# Altium project pcb2.PrjPcb
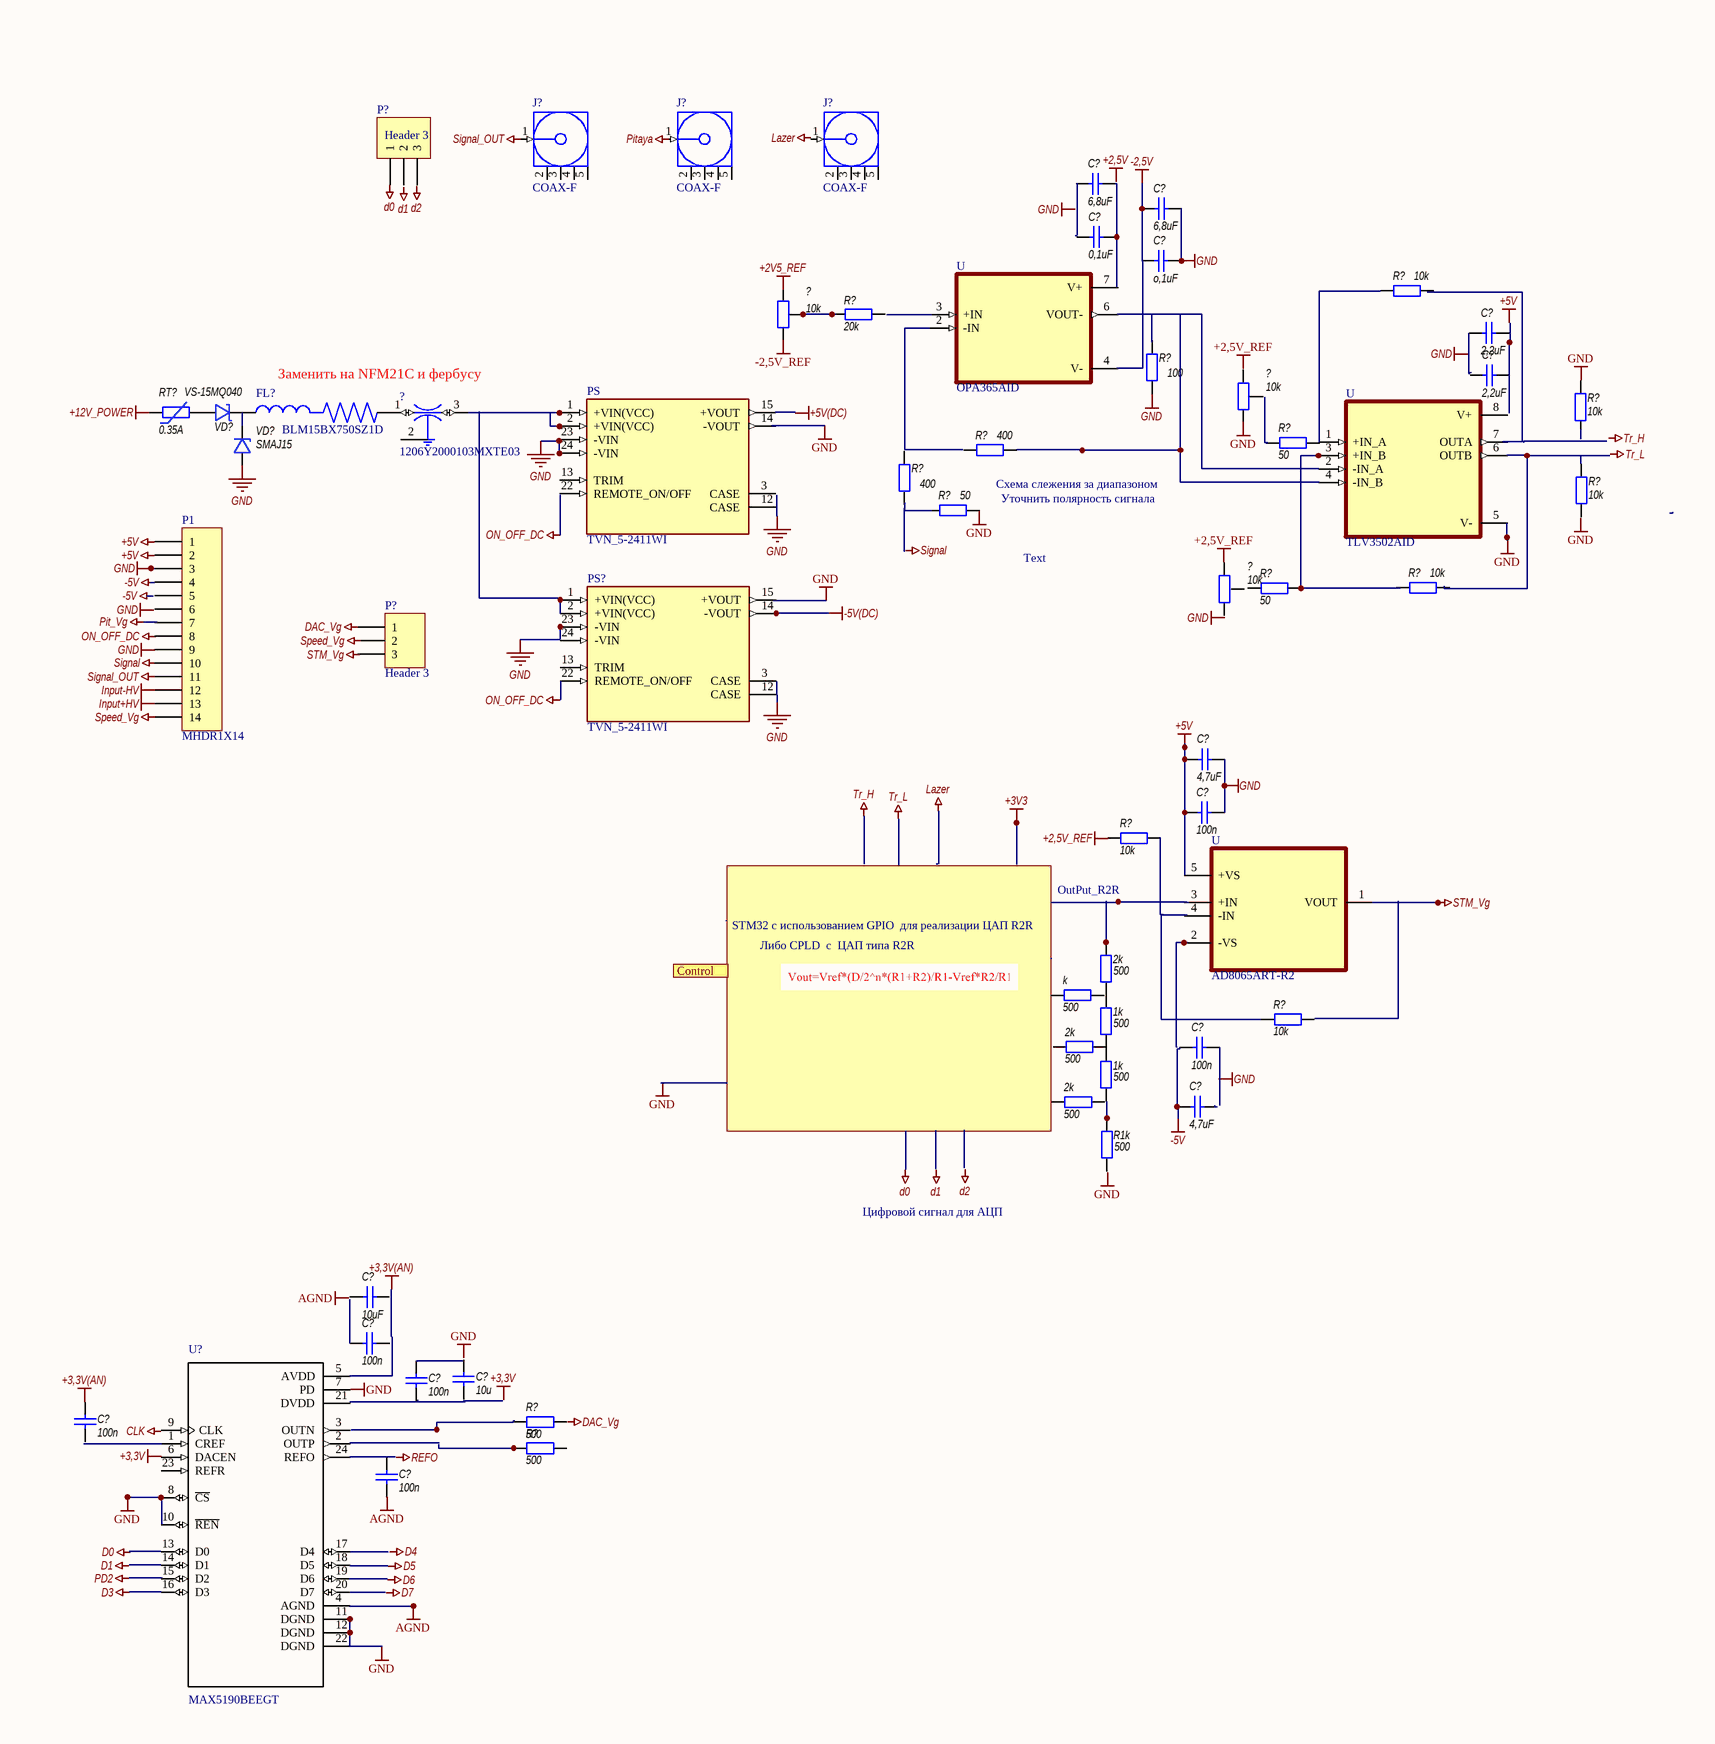
[diagram p0: Power_DC1.SchDoc, left]
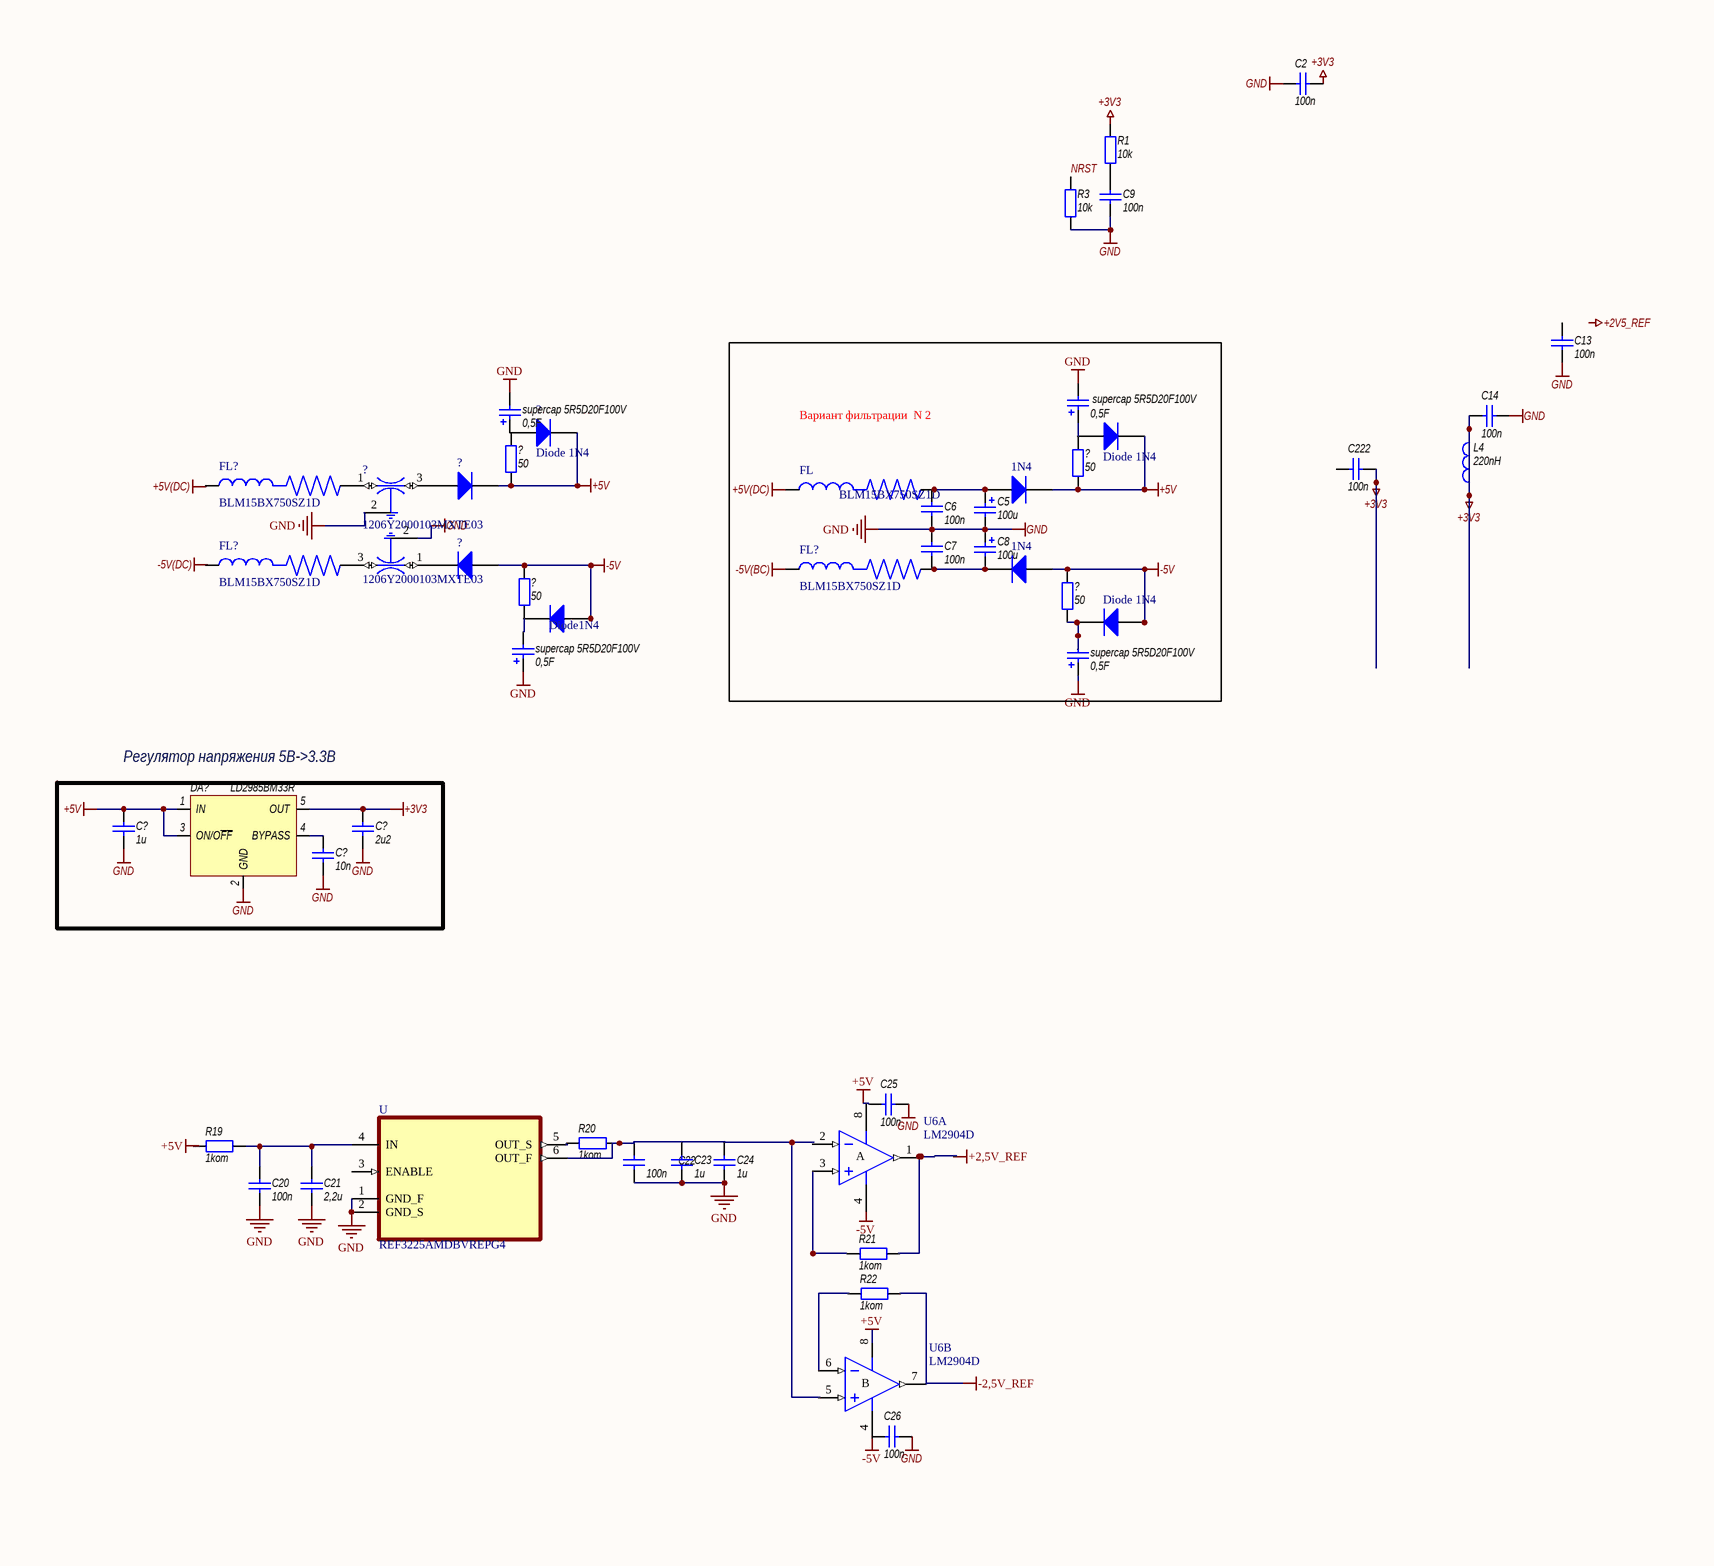
[diagram p1: Power_DC1.SchDoc, right]
1 sheet, 109 parts. Net scope: flat (ports and power ports of the same name join across sheets).

## Sheet Power_DC1.SchDoc
size A2

### Parts
(Parts that share a designator on the sheet are numbered #1, #2 ... from top to bottom, then left to right.)
1k#1  500  [0603]
1k#2  500  [0603]
1N4#1  (no value)  [DO-41]
1N4#2  (no value)  [DO-41]
2k#1  500  [0603]
2k#2  500  [0603]
2k#3  500  [0603]
?#1  Diode 1N4  [DO-41]
?#2  Diode 1N4  [DO-41]
?#3  (no value)  [DO-41]
?#4  1206Y2000103MXTE03  [FIL_1206Y2000103MXTE03]
?#5  50  [0603]
?#6  50  [0603]
?#7  10k  [R-Tr 3107W]
?#8  1206Y2000103MXTE03  [FIL_1206Y2000103MXTE03]
?#9  (no value)  [DO-41]
?#10  10k  [R-Tr 3107W]
?#11  50  [0603]
?#12  1206Y2000103MXTE03  [FIL_1206Y2000103MXTE03]
?#13  50  [0603]
?#14  Diode1N4  [DO-41]
?#15  10k  [R-Tr 3107W]
C2  100n  [0603]
C5  100u  [CAP TANTAL 6032 - Type C]
C6  100n  [0603]
C7  100n  [0603]
C8  100u  [CAP TANTAL 6032 - Type C]
C9  100n  [0603]
C13  100n  [0603]
C14  100n  [0603]
C20  100n  [0603]
C21  2,2u  [0603]
C22  100n  [0603]
C23  1u  [0603]
C24  1u  [0603]
C25  100n  [0603]
C26  100n  [0603]
C222  100n  [0603]
C?#1  6,8uF  [0603]
C?#2  6,8uF  [0603]
C?#3  0,1uF  [0603]
C?#4  o,1uF  [0603]
C?#5  2,2uF  [0603]
C?#6  2,2uF  [0603]
C?#7  1u  [0603]
C?#8  2u2  [0603]
C?#9  10n  [0603]
C?#10  4,7uF  [0603]
C?#11  100n  [0603]
C?#12  100n  [0603]
C?#13  4,7uF  [0603]
C?#14  10uF  [0603]
C?#15  100n  [0603]
C?#16  10u  [0603]
C?#17  100n  [0603]
C?#18  100n  [0603]
C?#19  100n  [0603]
DA?  LD2985BM33R  [SOT23-5]
Diode_1N4  (no value)  [DO-41]
FL  BLM15BX750SZ1D  [BEADC1005X55N]
FL?#1  BLM15BX750SZ1D  [BEADC1005X55N]
FL?#2  BLM15BX750SZ1D  [BEADC1005X55N]
FL?#3  BLM15BX750SZ1D  [BEADC1005X55N]
FL?#4  BLM15BX750SZ1D  [BEADC1005X55N]
J?#1  COAX-F  [MCX5.08-H5]
J?#2  COAX-F  [MCX5.08-H5]
J?#3  COAX-F  [MCX5.08-H5]
k  500  [0603]
L4  220nH  [0805]
P1  MHDR1X14  [MHDR1X14]
P?#1  Header 3  [HDR1X3]
P?#2  Header 3  [HDR1X3]
PS  TVN_5-2411WI  [CONV_TVN_5-2415WI]
PS?  TVN_5-2411WI  [CONV_TVN_5-2415WI]
R1  10k  [0603]
R1k  500  [0603]
R3  10k  [0603]
R19  1kom  [0603]
R20  1kom  [0603]
R21  1kom  [0603]
R22  1kom  [0603]
R?#1  10k  [0603]
R?#2  20k  [0603]
R?#3  10k  [0603]
R?#4  100  [0603]
R?#5  50  [0603]
R?#6  400  [0603]
R?#7  10k  [0603]
R?#8  400  [0603]
R?#9  50  [0603]
R?#10  50  [0603]
R?#11  10k  [0603]
R?#12  10k  [0603]
R?#13  10k  [0603]
R?#14  500  [0603]
R?#15  500  [0603]
RT?  0.35A  [1812]
supercap_5R5D20F100V#1  0,5F  [CAP TANTAL 6032 - Type C]
supercap_5R5D20F100V#2  0,5F  [CAP TANTAL 6032 - Type C]
supercap_5R5D20F100V#3  0,5F  [CAP TANTAL 6032 - Type C]
supercap_5R5D20F100V#4  0,5F  [CAP TANTAL 6032 - Type C]
U6  LM2904D  [SO8_L]  (parts A,B of 2)
U#1  OPA365AID  [SOIC127P599X175-8N]
U#2  TLV3502AID  [SOIC127P599X175-8N]
U#3  AD8065ART-R2  [SOT95P290X145-5N]
U#4  REF3225AMDBVREPG4  [SOT95P280X145-6N]
U?  MAX5190BEEGT  [*SOP63P602X175-24N]
VD?#1  VS-15MQ040  [DO-214AC (SMA)]
VD?#2  SMAJ15  [DO-214AC (SMA)]

### Blocks framed on the sheet
Вариант фильтрации  N 2: 1N4#1 1N4#2 ?#2 ?#6 ?#13 C5-C8 Diode_1N4 FL FL?#3 supercap_5R5D20F100V#1 supercap_5R5D20F100V#4

### Ports
Control (in)

### Nets
+3V3: C2.1 C14.1 C222.1 C?#8.2 DA?.5(OUT) L4.1 L4.2 R1.1
+5V: 1N4#1.2(K) ?#1.2(K) ?#2.2(K) ?#3.2(K) ?#5.1 ?#6.1 C25.2 C?#7.2 C?#10.1 C?#11.2 DA?.1(IN) DA?.3(ON/O~{FF}) U6.8(V+)
+5V(DC): FL.1
+12V_POWER: RT?.1
-2,5V_REF: U6.7(OUT)
-5V: 1N4#2.1(A) ?#9.1(A) ?#11.2 ?#13.2 ?#14.1(A) C26.2 C?#12.2 C?#13.1 Diode_1N4.1(A) P1.4
-5V(DC): PS?.14(-VOUT)
-5V(ВС): FL?#3.1
AGND: U?.4(AGND)
D0: P?#1.1
D3: U?.16(D3)
DAC_Vg: P?#2.1
GND: ?#4.2(GND) ?#8.2(GND) C2.2 C5.2 C6.1 C7.2 C8.1 C9.2 C13.2 C14.2 C20.1 C21.1 C22.1 C23.1 C24.1 C25.1 C26.1 C?#2.1 C?#4.1 C?#7.1 C?#8.1 C?#9.1 C?#10.2 C?#11.1 DA?.2(GND) P1.3 P1.9 PS.14(-VOUT) PS.24(-VIN) PS?.15(+VOUT) PS?.23(-VIN) R3.2 supercap_5R5D20F100V#1.2 supercap_5R5D20F100V#2.2 supercap_5R5D20F100V#3.1 supercap_5R5D20F100V#4.1 U#4.1(GND_F) U#4.2(GND_S) U?.8(~{CS}) U?.11(DGND) U?.12(DGND) U?.22(DGND) VD?#2.1(A)
Input+HV: P1.13
Input-HV: P1.12
Signal_OUT: J?#1.1(Signal) P1.11
Speed_Vg: P1.14
STM_Vg: U#3.1(VOUT)
NRST: R3.1
Net1N4#1_1: 1N4#1.1(A) C5.1 C6.2 FL.2
Net1N4#2_2: 1N4#2.2(K) C7.1 C8.2 FL?#3.2
Net?#1_1: ?#1.1(A) supercap_5R5D20F100V#2.1
Net?#3_1: ?#3.1(A) ?#4.3(B)
Net?#6_2: ?#6.2 supercap_5R5D20F100V#1.1
Net?#7_2: ?#7.2 R?#2.1
Net?#8_1: ?#8.1(A) ?#9.2(K)
Net?#11_1: ?#11.1 supercap_5R5D20F100V#3.2
Net?#12_3: ?#12.3(B) PS.1(+VIN(VCC)) PS.2(+VIN(VCC))
Net?#13_1: ?#13.1 Diode_1N4.2(K) supercap_5R5D20F100V#4.2
NetC9_1: C9.1 R1.2
NetC20_2: C20.2 C21.2 R19.1 U#4.4(IN)
NetC22_2: C22.2 R20.1 U#4.6(OUT_F)
NetC?#1_1: C?#1.1 C?#3.1
NetC?#2_2: C?#2.2 C?#4.2 U#1.4(V-)
NetC?#9_2: C?#9.2 DA?.4(BYPASS)
NetFL?#4_1: FL?#4.1 VD?#1.2(K) VD?#2.2(K)
NetPS?_1: PS?.1(+VIN(VCC)) PS?.2(+VIN(VCC))
NetR20_2: R20.2 U#4.5(OUT_S)
NetR?#4_2: R?#4.2 U#1.6(VOUT-)
NetR?#6_2: R?#6.2 U#2.4(-IN_B)
NetR?#8_1: R?#8.1 R?#9.1
NetR?#10_2: R?#10.2 R?#11.1 U#2.3(+IN_B)
NetRT?_2: RT?.2 VD?#1.1(A)

Not connected (* = marked no-connect by the designer): 1k#1 1 2; 1k#2 1 2; 2k#1 1 2; 2k#2 1 2; 2k#3 1 2; ?#2 1(A); ?#4 1(A); ?#5 2; ?#7 1 3; ?#8 3(B); ?#10 1 2 3; ?#12 1(A) 2(GND); ?#14 2(K); ?#15 1 2 3; C13 1; C23 2; C24 2; C222 2; C?#1 2; C?#3 2; C?#5 1 2; C?#6 1 2; C?#12 1; C?#13 2; C?#14 1 2; C?#15 1 2; C?#16 1 2; C?#17 1 2; C?#18 1 2; C?#19 1 2; FL?#1 1 2; FL?#2 1 2; FL?#4 2; J?#1 2(GND) 3(GND) 4(GND) 5(GND); J?#2 1(Signal) 2(GND) 3(GND) 4(GND) 5(GND); J?#3 1(Signal) 2(GND) 3(GND) 4(GND) 5(GND); k 1 2; P1 1 2 5 6 7 8 10; P?#1 2 3; P?#2 2 3; PS 3(CASE) 12(CASE) 13(TRIM) 15(+VOUT) 22(REMOTE_ON/OFF) 23(-VIN); PS? 3(CASE) 12(CASE) 13(TRIM) 22(REMOTE_ON/OFF) 24(-VIN); R1k 1 2; R19 2; R21 1 2; R22 1 2; R?#1 1 2; R?#2 2; R?#3 1 2; R?#4 1; R?#5 1 2; R?#6 1; R?#7 1 2; R?#8 2; R?#9 2; R?#10 1; R?#11 2; R?#12 1 2; R?#13 1 2; R?#14 1 2; R?#15 1 2; U6 1(OUT) 2(IN-) 3(IN+) 4(V-) 5(IN+) 6(IN-); U#1 2(-IN) 3(+IN) 7(V+); U#2 1(+IN_A) 2(-IN_A) 5(V-) 6(OUTB) 7(OUTA) 8(V+); U#3 2(-VS) 3(+IN) 4(-IN) 5(+VS); U#4 3(ENABLE); U? 1(CREF) 2(OUTP) 3(OUTN) 5(AVDD) 6(DACEN) 7(PD) 9(CLK) 10(~{REN}) 13(D0) 14(D1) 15(D2) 17(D4) 18(D5) 19(D6) 20(D7) 21(DVDD) 23(REFR) 24(REFO)

### Notes on the sheet
- Заменить на NFM21C и фербусу
- (near R?#6) Схема слежения за диапазоном
- (near R?#9) Уточнить полярность сигнала
- Text
- Регулятор напряжения 5В->3.3В
- OutPut_R2R
- STM32 с использованием GPIO  для реализации ЦАП R2R
- Либо CPLD  с  ЦАП типа R2R
- Цифровой сигнал для АЦП
- Labels drawn without touching a wire or pin: +2,5V, +2,5V_REF, +2V5_REF, +3,3V, +3,3V(AN), +5V, +5V(DC), -2,5V, -2,5V_REF, -5V, -5V(DC), AGND, CLK, d0, D0, d1, D1, d2, D4, D5, D6, D7, DAC_Vg, GND, Lazer, ON_OFF_DC, Pitaya, REFO, Signal, Speed_Vg, STM_Vg, Tr_H, Tr_L
- (in symbol LM2904D, part A) A
- (in symbol LM2904D, part B) B

### Library data of the parts
1k#1 1k#2 2k#1-2k#3 ?#5 ?#6 ?#11 ?#13 k R1k R?#2 R?#14 R?#15 = _resistor: Model: 0603 10k; Value: 10k
1N4#1 1N4#2 ?#1-?#3 ?#9 ?#14 Diode_1N4 = Diode 1N4934: 1 Amp Fast Recovery Rectifier; Published: 8-Jun-2000; LatestRevisionDate: 17-Jul-2002; LatestRevisionNote: Re-released for DXP Platform.; DatasheetVersion: 1999; PackageVersion: Aug-1999; PackageReference: DO-41; Publisher: Altium Limited; PackageDescription: Diode, Axial; Body 5.2 x 2.7 mm (LxDia. max), Lead Dia. 0.86 mm (max); Code_JEDEC: DO-204-AL; ComponentLink1Description: Manufacturer Link; ComponentLink1URL: http://www.fairchildsemi.com/; ComponentLink2Description: Datasheet; ComponentLink2URL: http://www.fairchildsemi.com/ds/1N%2F1N4934.pdf
?#4 ?#8 ?#12 = 1206Y2000103MXTE03: ÐŸÐ¸Ñ‚Ð°Ð½Ð¸Ðµ Ñ‡ÐµÑ€ÐµÐ· ÐºÐ¾Ð½Ð´ÐµÐ½ÑÐ°Ñ‚Ð¾Ñ€Ñ‹ 1206 200Ð’ .01uF 20% X7R X2y Ñ„Ð¸Ð»ÑŒÑ‚Ñ€; MF: Syfer; Availability: Unavailable; SnapEDA_Link: https://www.snapeda.com/parts/1206Y2000103MXTE03/Syfer/view-part/1659626/?ref=snap; Package: 1206 Syfer; MP: 1206Y2000103MXTE03; Value: *; Price: None
?#7 ?#10 ?#15 = _resistor_pot: Model: 3266P-1-102LF; Value: 1k
C2 C6 C7 C9 C13 C14 C20 C22 C25 C26 C222 C?#11 C?#12 C?#15 C?#17-C?#19 = _capacitor: Model: 0603 100n; Value: 100n
C5 C8 = _capacitor_pol: Model: Чип Тант. 6.3V 100uF 20% C; Value: 100u
C21 C23 C24 C?#1-C?#6 C?#10 C?#13 C?#14 C?#16 = _capacitor: Model: 0603 100n; Value: 100n
C?#7 = _capacitor: Model: 0603 1u; Value: 1u
C?#8 = _capacitor: Model: 0603 2u2; Value: 2u2
C?#9 = _capacitor: Model: 0603 10n; Value: 10n
DA? = LD2985: Linear Regulator; Model: LD2985BM33R; ComponentLink1URL: X:\Projects\__MY_AD_LIB\Datasheets\lp2985-n.pdf; ComponentLink1Description: Datasheet
FL FL?#1-FL?#4 = BLM15BX750SZ1D: Ñ„ÐµÑ€Ñ€Ð¸Ñ‚Ð¾Ð²Ð°Ñ ÑˆÐ°Ð¹Ð±Ð°; MF: Murata; SnapEDA_Link: https://www.snapeda.com/parts/BLM15BX750SZ1D/Murata/view-part/2734322/?ref=snap; Value: *; MP: BLM15BX750SZ1D; Availability: Unavailable; Package: 1005 Taiyo Yuden; Price: None
J?#1-J?#3 = COAX-F: RF Coaxial PCB Connector, MCX; Thru-Hole, Right-Angle Mount Socket, Blunt Post Terminal, 50 Ohm Impedance; PCB_Layout: Complies with manufacturer's recommendation.; DrillSize: Corresponds to nominal value.; Published: 15-Jul-2004; LatestRevisionDate: 15-Jul-2004; LatestRevisionNote: Component Replaced.; DatasheetDocument: 30-May-2003; PackageDocument: 04-Jul-1999; PackageReference: 919-119J-51AX; Publisher: Altium Limited; ComponentLink1Description: Manufacturer Link; ComponentLink1URL: http://www.amphenolrf.com/
L4 = _inductance: Inductance; Model: 0603 220nH; Value: 220nH
P1 = MHDR1X14: Header, 14-Pin; LatestRevisionDate: 17-Jul-2002; LatestRevisionNote: Re-released for DXP Platform.; Publisher: Altium Limited
P?#1 P?#2 = Header 3: Header, 3-Pin; LatestRevisionDate: 17-Jul-2002; LatestRevisionNote: Re-released for DXP Platform.; Publisher: Altium Limited
PS PS? = TVN_5-2415WI: Isolated Module DC DC Converter 1 Output 24V    208mA 9V - 36V Input; MF: Traco Power; MP: TVN 5-2415WI; SnapEDA_Link: https://www.snapeda.com/parts/TVN%205-2415WI/Traco%20Power/view-part/2758880/?ref=snap; Price: None; Package: DIP-24 Traco Power; Availability: Unavailable; Value: *
R1 R3 R?#3 R?#7 R?#12 R?#13 = _resistor: Model: 0603 10k; Value: 10k
R19-R22 R?#5 R?#8 R?#10 = _resistor: Model: 0603 100; Value: 100
R?#1 R?#6 R?#9 R?#11 = _resistor: Model: 0603 10; Value: 10
R?#4 = _resistor: Model: 0603 100; Value: 100
RT? = _termistor: Model: MF-MSMD035; Value: 0.35A
supercap_5R5D20F100V#1-supercap_5R5D20F100V#4 = _capacitor_pol: Model: T491C476K016AT; Value: 47u
U6 = LM2904D: Low-Power Dual Operational Amplifier; Published: 24-Aug-2001; LatestRevisionDate: 13-Apr-2006; LatestRevisionNote: IPC-7351 Footprint Added.; DatasheetVersion: Jan-1999; PackageVersion: Dec-2002; PackageReference: SO8; Publisher: Altium Limited; PackageDescription: 8-Pin Small Outline Integrated Circuit 1.27 mm Pitch; Code_JEDEC: MS-012-AA; Code_IPC: SOIC127P600-8; ComponentLink1Description: Manufacturer Link; ComponentLink1URL: http://www.st.com/; ComponentLink2Description: Datasheet; ComponentLink2URL: http://www.st.com/stonline/products/literature/ds/2471/lm2904.pdf
U#1 = OPA365AID: 2.2V, 50MHz, Low-Noise, Single-Supply Rail-to-Rail Operational Amplifier 8-SOIC -40 to 125; MF: Texas Instruments; Price: None; Package: SOIC-8 Texas Instruments; Value: *; MP: OPA365AID; DigiKey-Purchase-URL: https://snapeda.com/shop?store=DigiKey&id=214406; Availability: Warning; Mouser-Purchase-URL: https://snapeda.com/shop?store=Mouser&id=214406; SnapEDA_Link: https://www.snapeda.com/parts/OPA365AID/Texas%20Instruments/view-part/214406/?ref=snap; Texas_Instruments-Purchase-URL: https://snapeda.com/shop?store=Texas+Instruments&id=214406
U#2 = TLV3502AID: 4.5ns Rail-to-Rail Comparator; MF: Texas Instruments; Value: *; SnapEDA_Link: https://www.snapeda.com/parts/TLV3502AID/Texas%20Instruments/view-part/85753/?ref=snap; Arrow_Electronics-Purchase-URL: https://snapeda.com/shop?store=Arrow+Electronics&id=85753; Texas_Instruments-Purchase-URL: https://snapeda.com/shop?store=Texas+Instruments&id=85753; Mouser-Purchase-URL: https://snapeda.com/shop?store=Mouser&id=85753; Availability: Unavailable; Price: None; Package: SOIC-8 Texas Instruments; DigiKey-Purchase-URL: https://snapeda.com/shop?store=DigiKey&id=85753; MP: TLV3502AID
U#3 = AD8065ART-R2: Ð£ÑÐ¸Ð»Ð¸Ñ‚ÐµÐ»ÑŒ Ð¾Ð±Ñ€Ð°Ñ‚Ð½Ð¾Ð¹ ÑÐ²ÑÐ·Ð¸ Ð¿Ð¾ Ð½Ð°Ð¿Ñ€ÑÐ¶ÐµÐ½Ð¸ÑŽ 1 Ñ†ÐµÐ¿ÑŒ Ñ€ÐµÐ»ÑŒÑ-Ñ€ÐµÐ»ÑŒÑ SOT-23-5; MF: Analog Devices; MP: AD8065ART-R2; Package: SOT-23-5 Analog Devices; SnapEDA_Link: https://www.snapeda.com/parts/AD8065ART-R2/Analog%20Devices%20Inc./view-part/888431/?ref=snap; Price: None; Availability: Unavailable; Value: *; DigiKey-Purchase-URL: https://snapeda.com/shop?store=DigiKey&id=888431
U#4 = REF3225AMDBVREPG4: Ð£Ð²ÐµÐ»Ð¸Ñ‡ÐµÐ½Ð½Ñ‹Ð¹ Ð¿Ñ€Ð¾Ð´ÑƒÐºÑ‚ 4 Ppm/Degreesc 100 UA Sot23-6 ÑÐµÑ€Ð¸Ñ ÑÐ¿Ñ€Ð°Ð²ÐºÐ¸ Ð½Ð°Ð¿Ñ€ÑÐ¶ÐµÐ½Ð¸Ñ Ñ‚Ð¾ÐºÐ° 6-SOT-23 -55 Ð´Ð¾ 125; MF: Texas Instruments; Package: SOT-23 Texas Instruments; Value: *; Availability: Unavailable; SnapEDA_Link: https://www.snapeda.com/parts/REF3225AMDBVREPG4/Texas%20Instruments/view-part/575270/?ref=snap; Price: None; MP: REF3225AMDBVREPG4
VD?#1 = _diod_schottky: Model: VS-15MQ040
VD?#2 = _diode_zener: Model: SMAJ15
U? = MAX5190BEEGT: SnapEDA_Link: https://www.snapeda.com/parts/MAX5190BEEG+/Maxim%20Integrated/view-part/632278/?ref=snap; Value: *